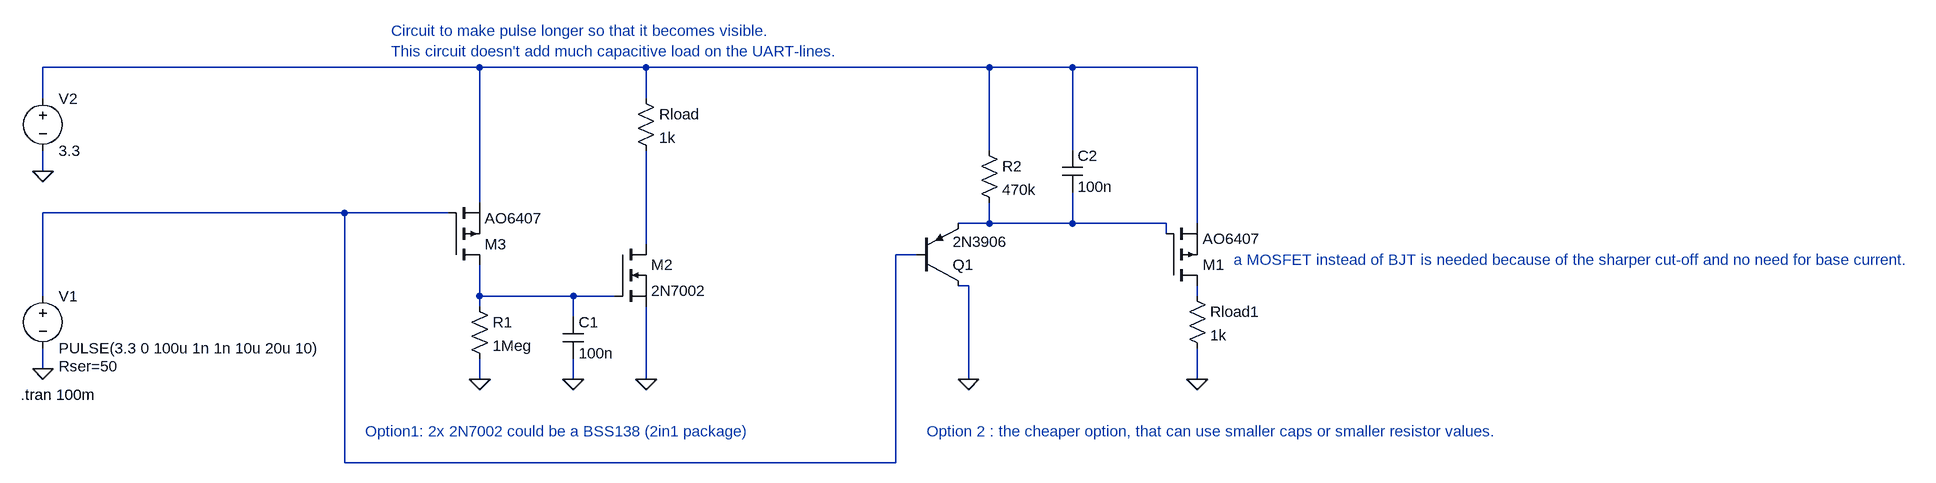
[diagram p0: schematic LED-TXRX.asc]
LED-TXRX.asc, the LTspice schematic file:
Version 4
SHEET 1 2464 756
WIRE 192 -192 -480 -192
WIRE 448 -192 192 -192
WIRE 976 -192 448 -192
WIRE 1104 -192 976 -192
WIRE 1296 -192 1104 -192
WIRE -480 -144 -480 -192
WIRE 448 -144 448 -192
WIRE 976 -64 976 -192
WIRE 1104 -64 1104 -192
WIRE -480 -32 -480 -64
WIRE 192 16 192 -192
WIRE -16 32 -480 32
WIRE 144 32 -16 32
WIRE 976 48 976 16
WIRE 976 48 928 48
WIRE 1104 48 1104 0
WIRE 1104 48 976 48
WIRE 1248 48 1104 48
WIRE 1296 48 1296 -192
WIRE 1248 64 1248 48
WIRE 448 80 448 -64
WIRE 864 96 832 96
WIRE 944 144 928 144
WIRE -480 160 -480 32
WIRE 192 160 192 112
WIRE 336 160 192 160
WIRE 400 160 336 160
WIRE 1296 160 1296 144
WIRE 192 176 192 160
WIRE 336 192 336 160
WIRE -480 272 -480 240
WIRE 192 288 192 256
WIRE 336 288 336 256
WIRE 448 288 448 176
WIRE 944 288 944 144
WIRE 1296 288 1296 240
WIRE -16 416 -16 32
WIRE 832 416 832 96
WIRE 832 416 -16 416
FLAG -480 -32 0
FLAG -480 272 0
FLAG 192 288 0
FLAG 336 288 0
FLAG 448 288 0
FLAG 1296 288 0
FLAG 944 288 0
SYMBOL voltage -480 144 R0
WINDOW 123 0 0 Left 0
WINDOW 39 24 124 Left 2
SYMATTR InstName V1
SYMATTR Value PULSE(3.3 0 100u 1n 1n 10u 20u 10)
SYMATTR SpiceLine Rser=50
SYMBOL pmos 1248 144 M180
SYMATTR InstName M1
SYMATTR Value AO6407
SYMBOL res 176 160 R0
SYMATTR InstName R1
SYMATTR Value 1Meg
SYMBOL cap 320 192 R0
SYMATTR InstName C1
SYMATTR Value 100n
SYMBOL nmos 400 80 R0
SYMATTR InstName M2
SYMATTR Value 2N7002
SYMBOL res 432 -160 R0
SYMATTR InstName Rload
SYMATTR Value 1k
SYMBOL voltage -480 -160 R0
SYMATTR InstName V2
SYMATTR Value 3.3
SYMBOL pnp 864 144 M180
SYMATTR InstName Q1
SYMATTR Value 2N3906
SYMBOL cap 1088 -64 R0
SYMATTR InstName C2
SYMATTR Value 100n
SYMBOL res 1280 144 R0
SYMATTR InstName Rload1
SYMATTR Value 1k
SYMBOL res 960 -80 R0
SYMATTR InstName R2
SYMATTR Value 470k
SYMBOL pmos 144 112 M180
SYMATTR InstName M3
SYMATTR Value AO6407
TEXT -514 312 Left 2 !.tran 100m
TEXT 56 -248 Left 2 ;Circuit to make pulse longer so that it becomes visible.\nThis circuit doesn't add much capacitive load on the UART-lines.
TEXT 16 368 Left 2 ;Option1: 2x 2N7002 could be a BSS138 (2in1 package)
TEXT 880 368 Left 2 ;Option 2 : the cheaper option, that can use smaller caps or smaller resistor values.
TEXT 1352 104 Left 2 ;a MOSFET instead of BJT is needed because of the sharper cut-off and no need for base current.

The netlist it stands for:
* LED-TXRX.asc
V1 N002 0 PULSE(3.3 0 100u 1n 1n 10u 20u 10) Rser=50
M1 N006 N003 N001 N001 AO6407
R1 N005 0 1Meg
C1 N005 0 100n
M2 N004 N005 0 0 2N7002
Rload N001 N004 1k
V2 N001 0 3.3
Q1 0 N002 N003 0 2N3906
C2 N001 N003 100n
Rload1 N006 0 1k
R2 N001 N003 470k
M3 N005 N002 N001 N001 AO6407
.model NPN NPN
.model PNP PNP
.lib standard.bjt
.model NMOS NMOS
.model PMOS PMOS
.lib standard.mos
.tran 100m
* Circuit to make pulse longer so that it becomes visible.
* This circuit doesn't add much capacitive load on the UART-lines.
* Option1: 2x 2N7002 could be a BSS138 (2in1 package)
* Option 2 : the cheaper option, that can use smaller caps or smaller resistor values.
* a MOSFET instead of BJT is needed because of the sharper cut-off and no need for base current.
.backanno
.end